# EasyEDA Pro project 单相逆变离并网和整流拓扑.epro, board PCB1
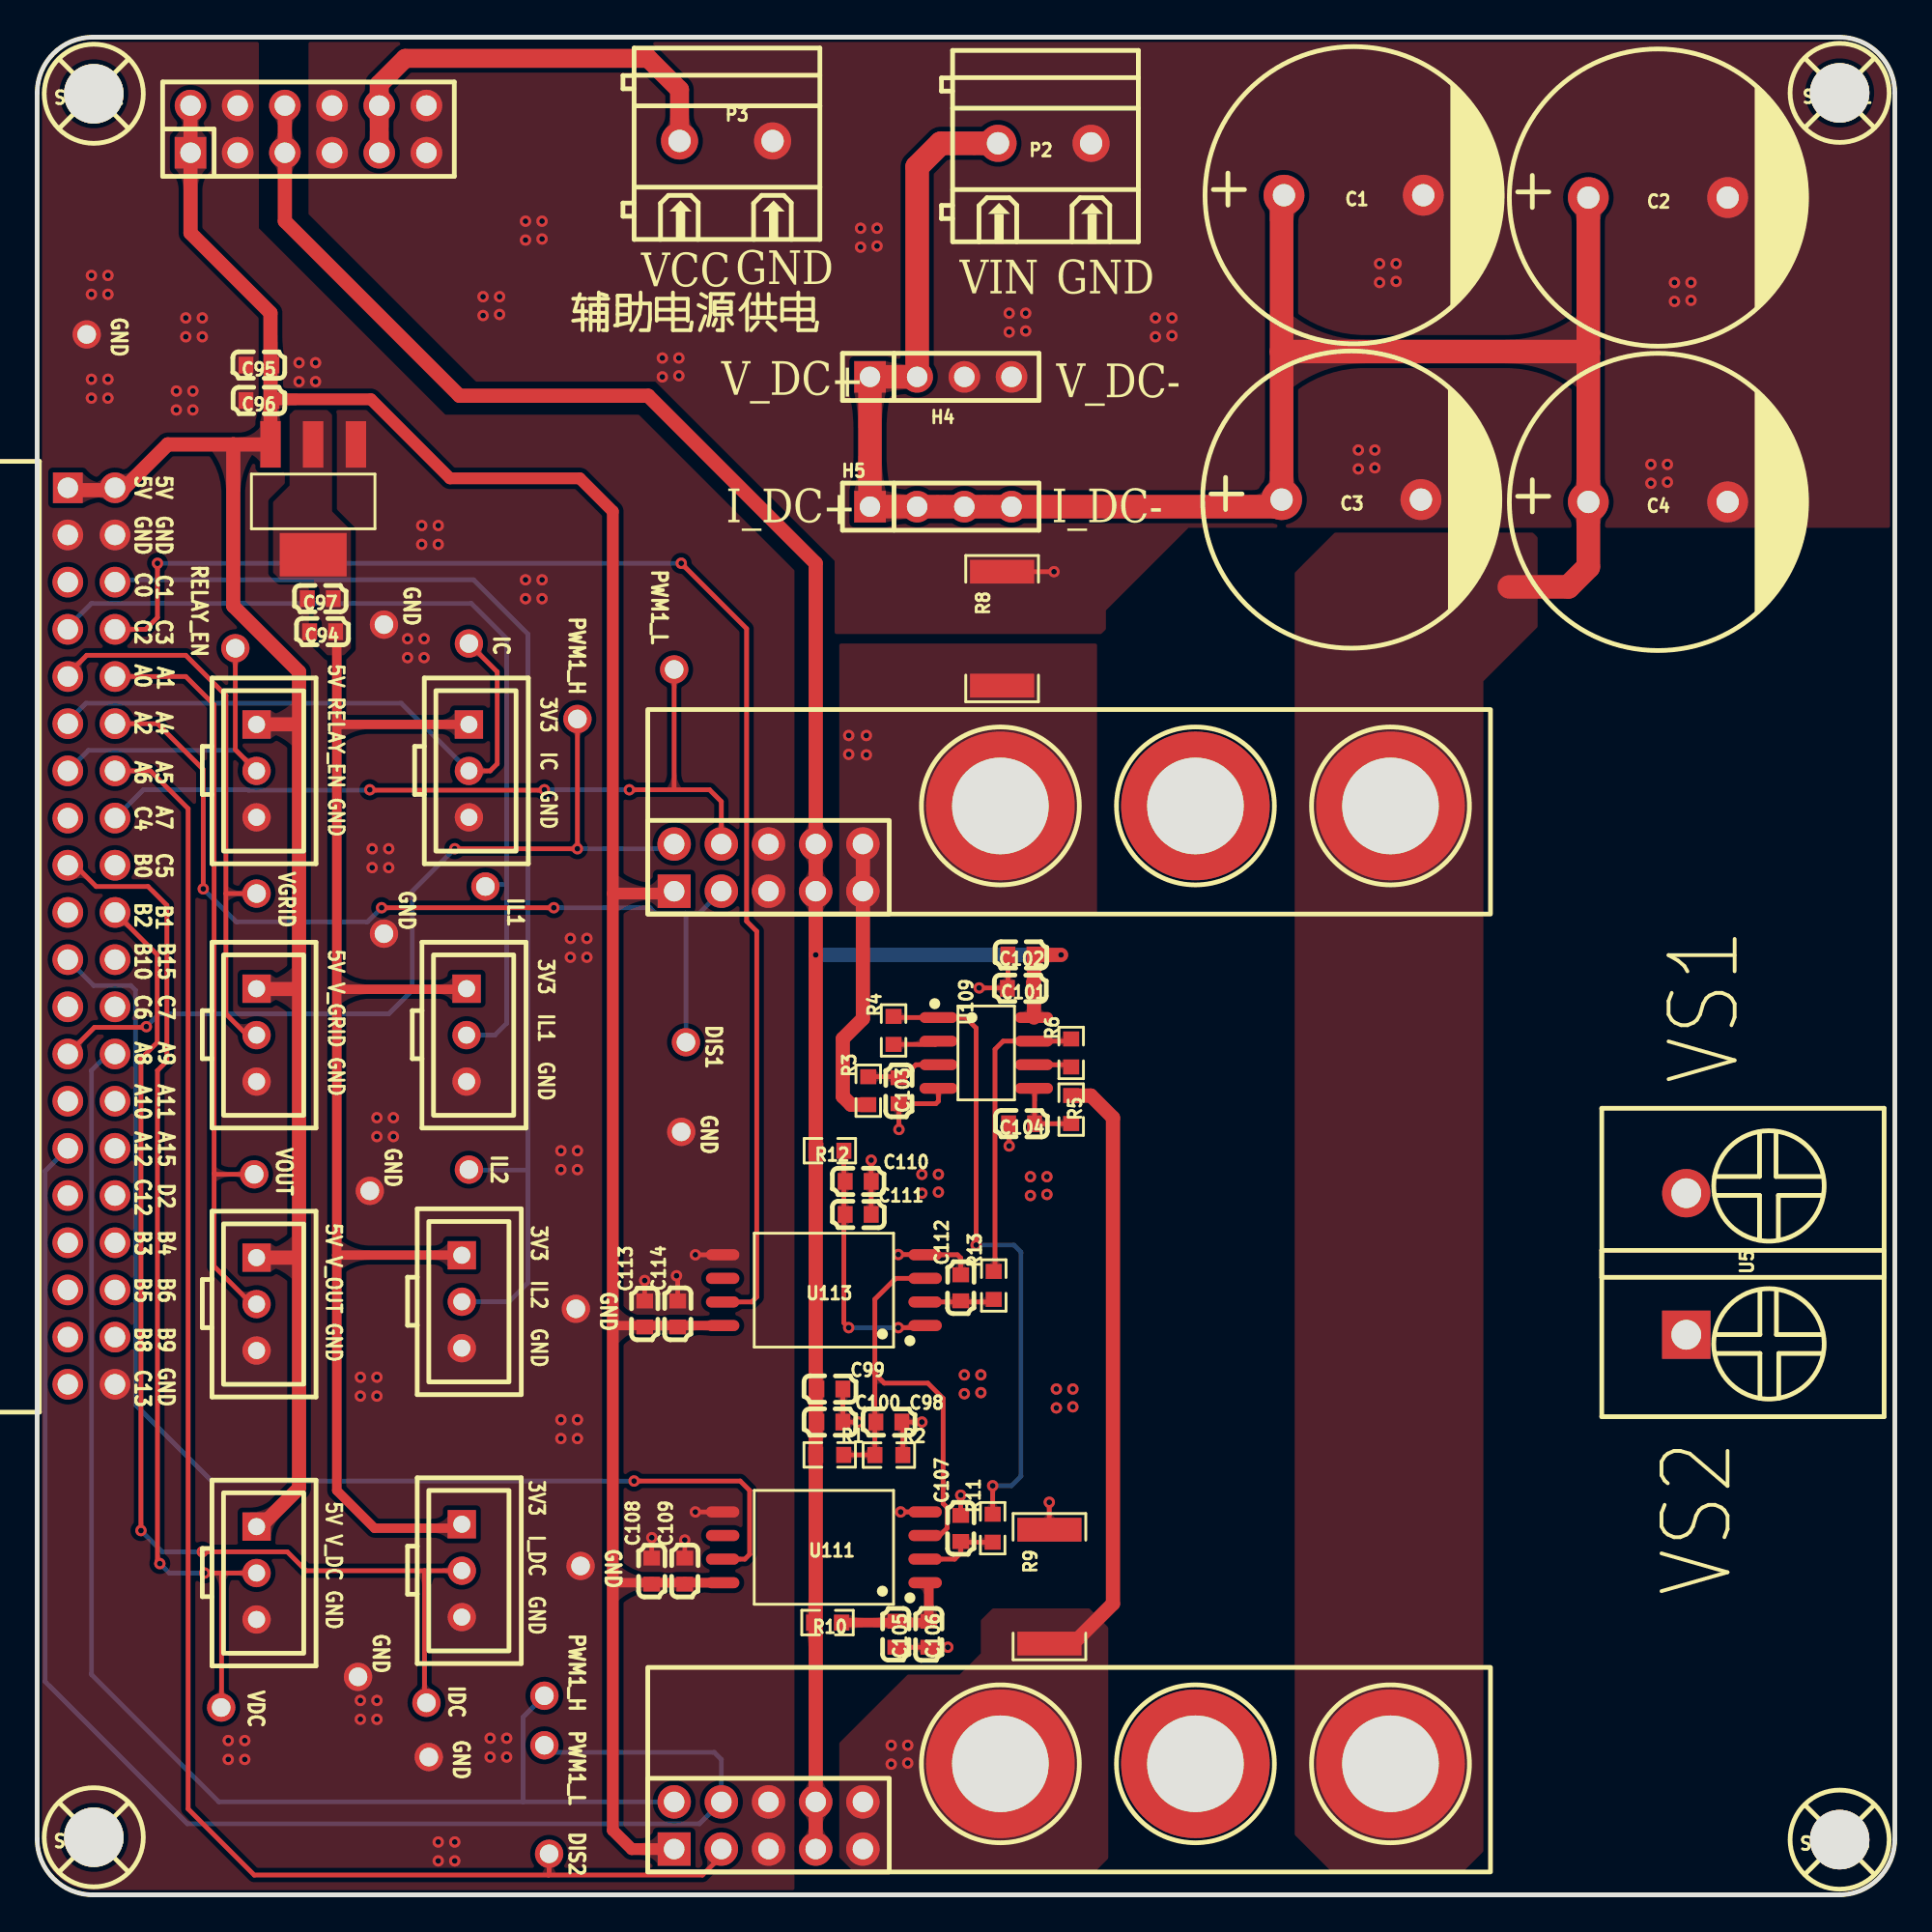
[diagram p4: board, top side]
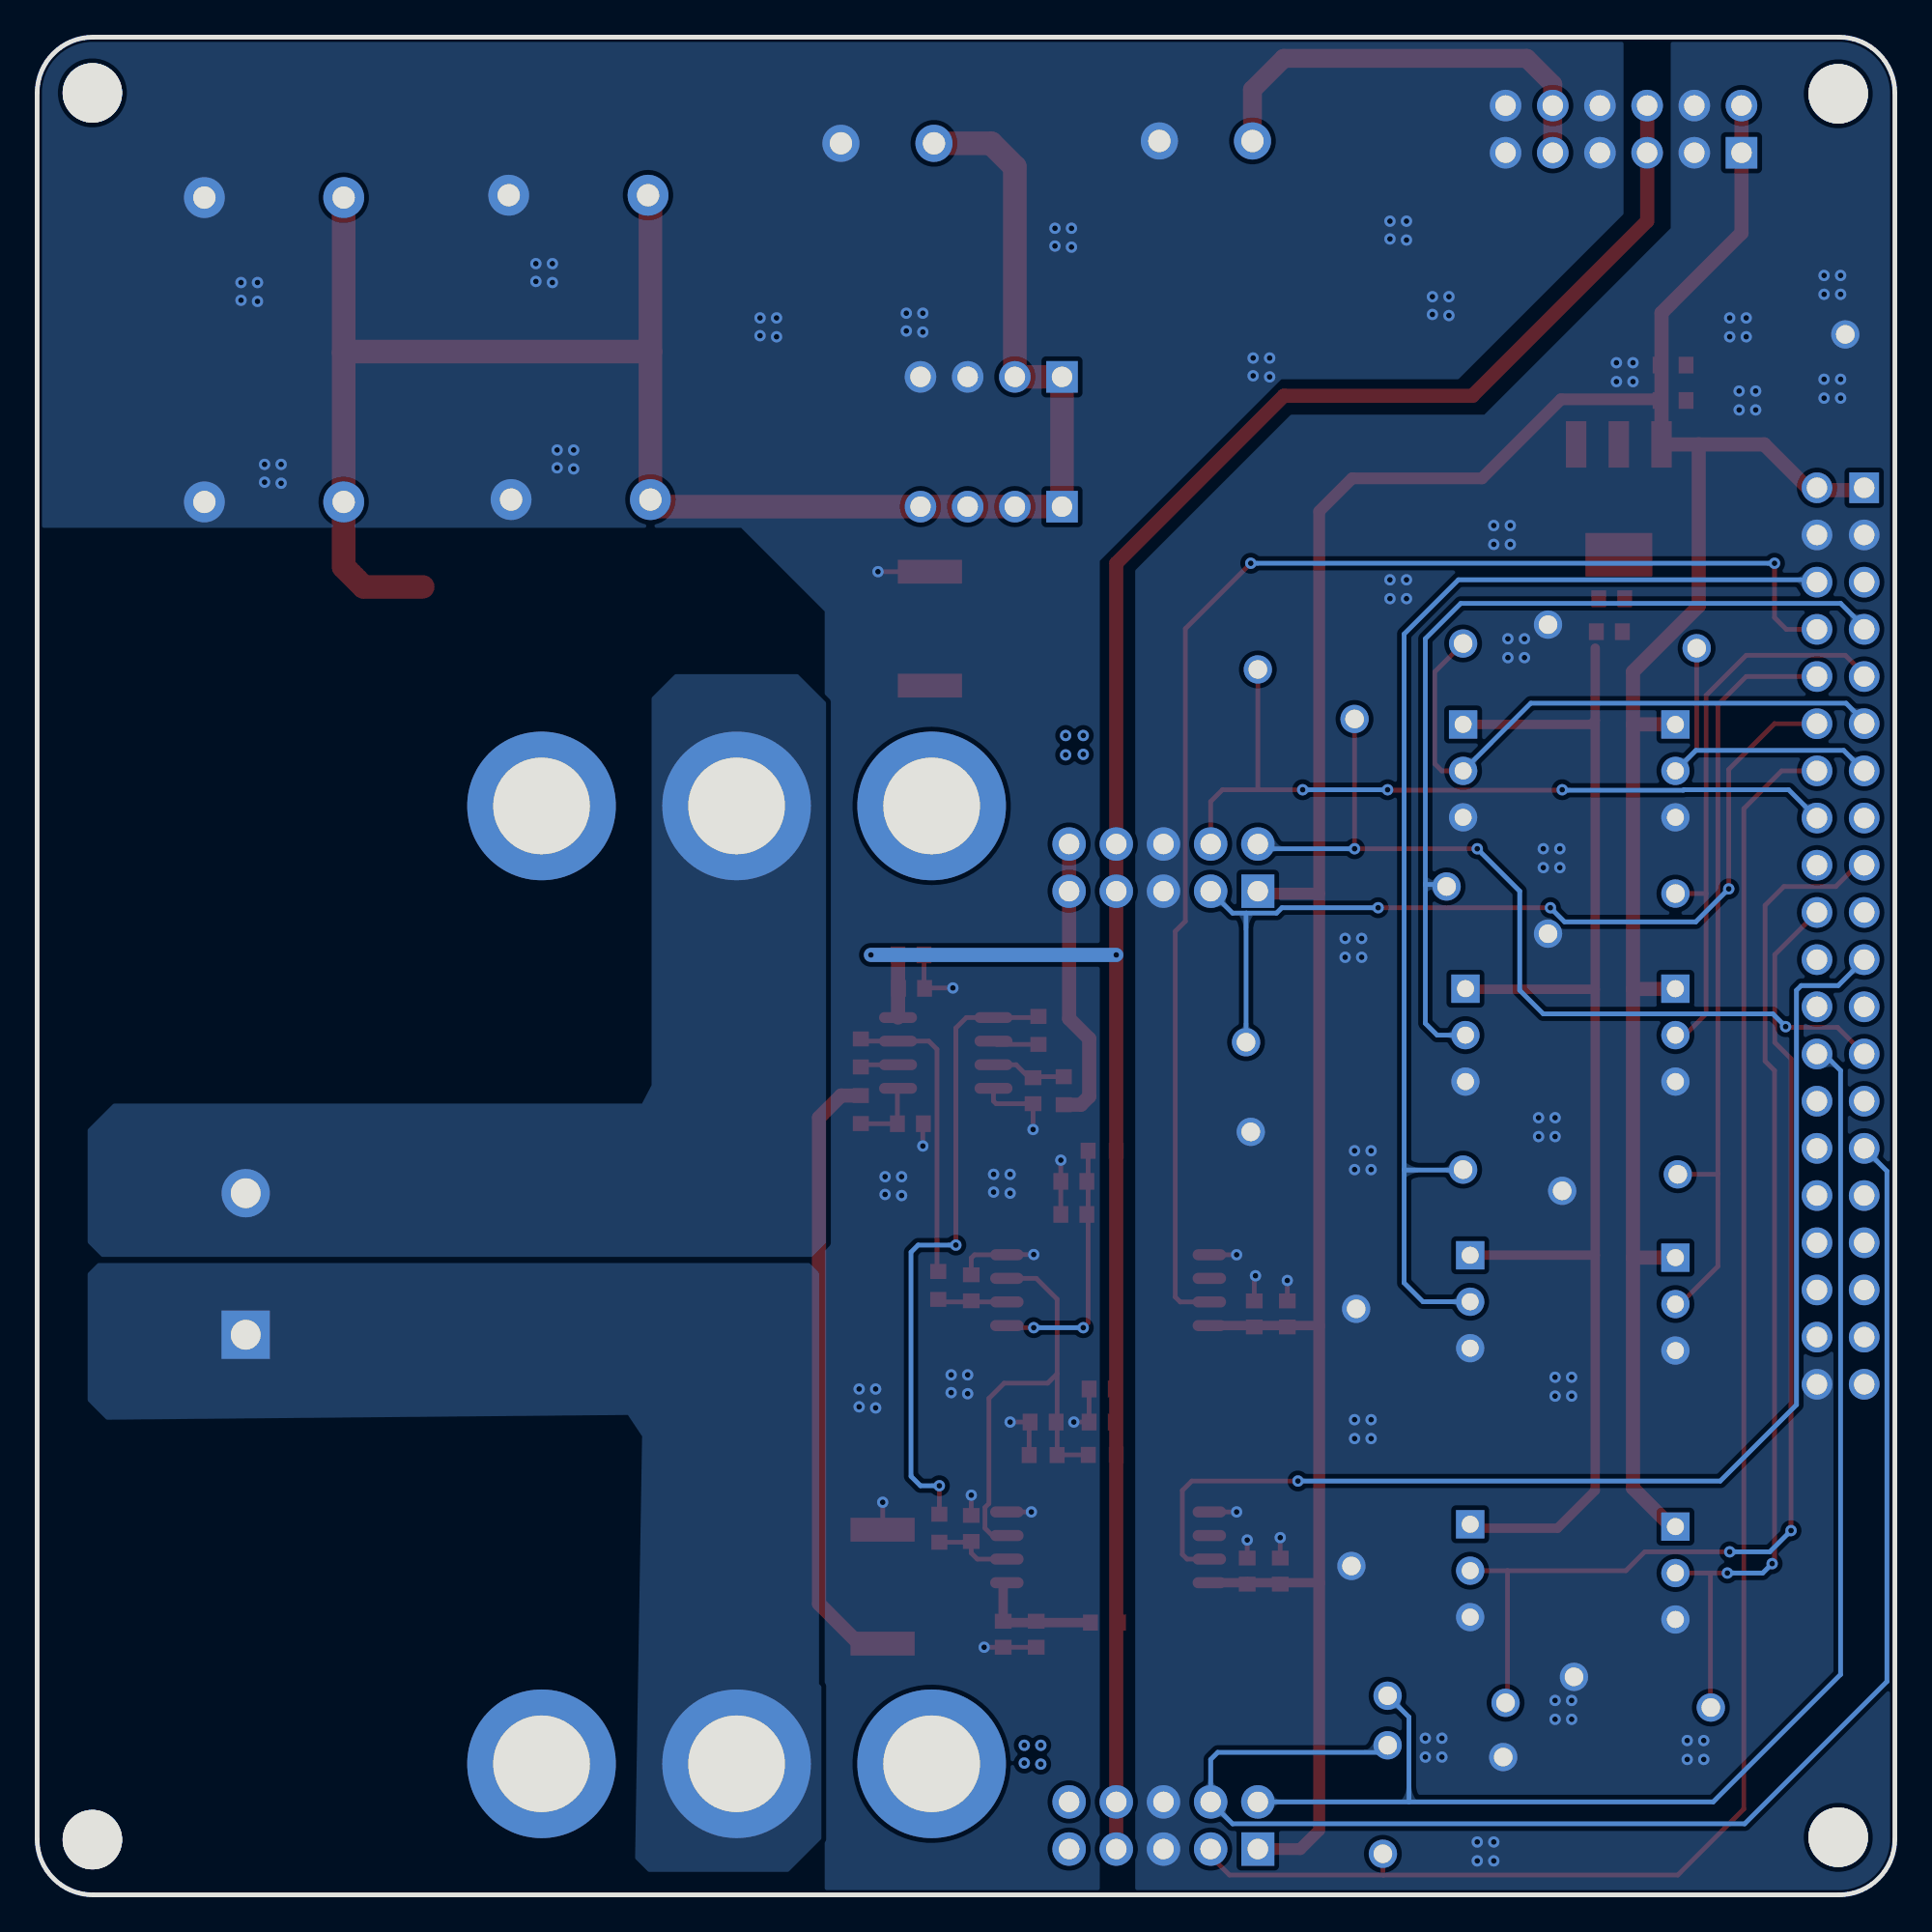
[diagram p5: board, bottom side, seen from below]

Outline 100 x 100 mm; copper layers: Top Layer, Bottom Layer. Coordinates in mm from the lower left corner of the outline.
Outline path: 0,97 0,3 arc(0.88,0.88) 3,0 97,0 arc(99.12,0.88) 100,3 100,97 arc(99.12,99.12) 97,100 3,100 arc(0.88,99.12) 0,97
Stack: Top Layer 0.035mm / Dielectric1 1.51mm FR4 er 4.5 / Bottom Layer 0.035mm

## Design rules (mm)
template: 自定义配置
spacing copperThickness1oz (default): track to track 0.102, other pairs 0.152 to 0.3
spacing copperThickness2oz: track to track 0.203, other pairs 0.152 to 0.3
track width copperThickness1oz (default): min 0.127, default 0.254, max 2.54
track width copperThickness2oz: min 0.203, default 0.254, max 2.54
differential pair differentialPair (default): width min 0.127, default 0.254, max 2.54; gap min 0.152, default 0.152
via viaSize (default): diameter min 0.5, default 0.61, max 10; hole min 0.3, default 0.305, max 6.3

## Placement (name value [footprint] x y rotation side)
5VADC1GND1  WAFER-XH2.54-3PZZ  [CONN-TH_3P-P2.50_WAFER-XH2.54-3PZZ]  11.81 31.8 270 top
5VADC2GND1  WAFER-XH2.54-3PZZ  [CONN-TH_3P-P2.50_WAFER-XH2.54-3PZZ]  11.81 46.28 270 top
5VADC3GND1  WAFER-XH2.54-3PZZ  [CONN-TH_3P-P2.50_WAFER-XH2.54-3PZZ]  11.81 60.5 270 top
5VADC3GND2  WAFER-XH2.54-3PZZ  [CONN-TH_3P-P2.50_WAFER-XH2.54-3PZZ]  11.81 17.32 270 top
5VADC4GND1  WAFER-XH2.54-3PZZ  [CONN-TH_3P-P2.50_WAFER-XH2.54-3PZZ]  22.86 31.93 270 top
5VADC4GND2  WAFER-XH2.54-3PZZ  [CONN-TH_3P-P2.50_WAFER-XH2.54-3PZZ]  22.86 17.45 270 top
5VADC6GND1  WAFER-XH2.54-3PZZ  [CONN-TH_3P-P2.50_WAFER-XH2.54-3PZZ]  23.11 46.28 270 top
5VADC7GND1  WAFER-XH2.54-3PZZ  [CONN-TH_3P-P2.50_WAFER-XH2.54-3PZZ]  23.24 60.5 270 top
AMS1117  A1117-3.3  [SOT-223-3_L6.5-W3.4-P2.30-LS7.0-BR-1]  14.86 75.11 90 top
C1  470uF  [CAP-TH_BD16.0-P7.50-D0.8-FD]  70.87 91.49 0 top
C2  470uF  [CAP-TH_BD16.0-P7.50-D0.8-FD]  87.25 91.36 0 top
C3  470uF  [CAP-TH_BD16.0-P7.50-D0.8-FD]  70.74 75.11 0 top
C4  470uF  [CAP-TH_BD16.0-P7.50-D0.8-FD]  87.25 74.98 0 top
C94  100nF  [电容（0603）]  15.37 68 0 top
C95  100nF  [电容（0603）]  11.94 82.35 0 top
C96  10uF  [C0603]  11.94 80.44 0 top
C97  10uF  [C0603]  15.24 69.77 0 top
C98  10nF  [电容（0603）]  45.85 25.45 180 top
C99  100nF  [电容（0603）]  42.67 27.23 180 top
C100  10uF  [C0603]  42.67 25.45 180 top
C101  100nF  [电容（0603）]  52.93 48.8 0 top
C102  10uF  [C0603]  52.96 50.6 0 top
C103  10nF  [电容（0603）]  46.39 43.29 90 top
C104  10nF  [电容（0603）]  52.99 41.51 0 top
C105  1uF  [C0603]  46.22 14.03 90 top
C106  100nF  [电容（0603）]  48 14.03 90 top
C107  1nF  [电容（0603）]  49.72 19.72 270 top
C108  1uF  [C0603]  33.08 17.43 270 top
C109  100nF  [电容（0603）]  34.86 17.43 270 top
C110  1uF  [C0603]  44.2 38.4 180 top
C111  100nF  [电容（0603）]  44.2 36.63 180 top
C112  1nF  [电容（0603）]  49.72 32.68 270 top
C113  1uF  [C0603]  32.7 31.27 270 top
C114  100nF  [电容（0603）]  34.48 31.27 270 top
H4  直流侧电压检测  [HDR-TH_4P-P2.54-V-F]  48.64 81.71 0 top
H5  直流侧电流检测  [HDR-TH_4P-P2.54-V-F]  48.64 74.73 0 top
NOREF  -  [Pad_e479]  18.67 68.38 0 top
NOREF#2  -  [Pad_e482]  27.56 2.21 0 top
NOREF#3  -  [Pad_e566]  9.91 10.08 0 top
NOREF#4  -  [Pad_e515]  10.67 67.11 0 top
NOREF#5  -  [Pad_e481]  27.31 8.05 0 top
NOREF#6  -  [Pad_e459]  34.93 45.9 0 top
NOREF#7  -  [Pad_e480]  27.31 10.72 0 top
NOREF#8  -  [Pad_e470]  2.67 84 0 top
NOREF#9  -  [Pad_e511]  29 31.55 0 top
NOREF#10  -  [Pad_e509]  18.67 51.74 0 top
NOREF#11  -  [Pad_e476]  34.67 41.07 0 top
NOREF#12  -  [Pad_e553]  11.68 38.79 0 top
NOREF#13  -  [Pad_e533]  11.81 53.9 0 top
NOREF#14  -  [Pad_e551]  17.27 11.73 0 top
NOREF#15  -  [Pad_e554]  23.24 39.04 0 top
NOREF#16  -  [Pad_e549]  17.91 37.9 0 top
NOREF#17  -  [Pad_e540]  24.13 54.28 0 top
NOREF#18  -  [Pad_e513]  29.25 17.7 0 top
NOREF#19  -  [Pad_e485]  21.08 7.42 0 top
NOREF#20  -  [Pad_e567]  20.95 10.34 0 top
NOREF#21  -  [Pad_e426]  34.29 65.96 0 top
NOREF#22  -  [Pad_e516]  23.24 67.36 0 top
NOREF#23  -  [Pad_e405]  29.08 63.3 0 top
P2  WJ128V-5.0-2P  [CONN-TH_2P-P5.00_WJ128V-5.0-2P]  54.23 94.28 0 top
P3  WJ128V-5.0-2P  [CONN-TH_2P-P5.00_WJ128V-5.0-2P]  37.08 94.41 0 top
R1  5.1kΩ  [R0603]  42.66 23.68 180 top
R2  200Ω  [R0603]  45.85 23.67 180 top
R3  10kΩ  [R0603]  44.74 43.29 270 top
R4  10kΩ  [R0603]  46.1 46.53 270 top
R5  10kΩ  [R0603]  55.66 42.27 90 top
R6  10kΩ  [R0603]  55.66 45.32 270 top
R8  0.1Ω  [R2512]  51.94 68.16 270 top
R9  0.1Ω  [R2512]  54.49 16.59 270 top
R10  10Ω  [R0603]  42.54 14.66 0 top
R11  10Ω  [R0603]  51.44 19.74 270 top
R12  10Ω  [R0603]  42.67 40.06 0 top
R13  10Ω  [R0603]  51.49 32.8 270 top
SCREW1  -  [M3螺丝]  97.03 97 0 top
SCREW2  -  [M3螺丝]  3.05 96.95 0 top
SCREW3  -  [M3螺丝]  97.03 2.97 0 top
SCREW4  -  [M3螺丝]  3.05 3.1 0 top
U1  -  [辅助电源板卡-60-12-5]  14.61 95.05 0 top
U3  -  [UCC21520DWR直插封装]  39.37 55.3 0 top
U4  -  [UCC21520DWR直插封装]  39.37 3.73 0 top
U5  桥臂输出  [CONN-TH_2P-P7.62_L15.2-W16.7-EX4.2]  88.77 33.96 90 top
U108  PZ254-2-20-W-8.5  [HDR-TH_40P-P2.54-H-M-R2-C20-S2.54-W12.9-N]  2.92 51.61 270 top
U109  OPA2188AIDR  [SOIC-8_L4.9-W3.9-P1.27-LS6.0-BL]  51.09 45.32 270 top
U111  AMC23C10DWVR  [SOIC-8_L7.5-W5.9-P1.27-LS11.5-BL]  42.35 18.71 90 top
U113  AMC23C10DWVR  [SOIC-8_L7.5-W5.9-P1.27-LS11.5-BL]  42.35 32.55 90 top

## Footprints (pads in the part's own frame, mm; a bottom-side part is the same pattern mirrored in y, then rotated)
C0603
  rect 0.8x0.9 smd: 1(-0.7,0) 2(0.7,0)
CAP-TH_BD16.0-P7.50-D0.8-FD
  round 2.2 hole 1.2: 1(-3.75,0) 2(3.75,0)
CONN-TH_2P-P5.00_WJ128V-5.0-2P
  round 2 hole 1.2: 1(-2.505,0) 2(2.505,0)
CONN-TH_2P-P7.62_L15.2-W16.7-EX4.2
  rect 2.6x2.6 hole 1.6: 1(-3.81,0)
  round 2.6 hole 1.6: 2(3.81,0)
CONN-TH_3P-P2.50_WAFER-XH2.54-3PZZ
  rect 1.524x1.524 hole 0.914: 1(-2.5,0)
  round 1.524 hole 0.914: 2(0,0) 3(2.5,0)
HDR-TH_4P-P2.54-V-F
  rect 1.7x1.7 hole 1.1: 1(-3.81,0)
  round 1.7 hole 1.1: 2(-1.27,0) 3(1.27,0) 4(3.81,0)
HDR-TH_40P-P2.54-H-M-R2-C20-S2.54-W12.9-N
  rect 1.65x1.6 hole 1.1: 1(-24.13,-1.27)
  round 1.65 hole 1.1: 2(-24.13,1.27) 3(-21.59,-1.27) 4(-21.59,1.27) 5(-19.05,-1.27) 6(-19.05,1.27) 7(-16.51,-1.27) 8(-16.51,1.27) 9(-13.97,-1.27) 10(-13.97,1.27) 11(-11.43,-1.27) 12(-11.43,1.27) 13(-8.89,-1.27) 14(-8.89,1.27) 15(-6.35,-1.27) 16(-6.35,1.27) 17(-3.81,-1.27) 18(-3.81,1.27) 19(-1.27,-1.27) 20(-1.27,1.27) 21(1.27,-1.27) 22(1.27,1.27) 23(3.81,-1.27) 24(3.81,1.27) 25(6.35,-1.27) 26(6.35,1.27) 27(8.89,-1.27) 28(8.89,1.27) 29(11.43,-1.27) 30(11.43,1.27) 31(13.97,-1.27) 32(13.97,1.27) 33(16.51,-1.27) 34(16.51,1.27) 35(19.05,-1.27) 36(19.05,1.27) 37(21.59,-1.27) 38(21.59,1.27) 39(24.13,-1.27) 40(24.13,1.27)
M3螺丝
  round 3.2 hole 3.2: 1(0,0)
Pad_e405
  round 1.524 hole 1: 1(0,0)
Pad_e426
  round 1.524 hole 1: 1(0,0)
Pad_e459
  round 1.524 hole 1: 1(0,0)
Pad_e470
  round 1.524 hole 1: 1(0,0)
Pad_e476
  round 1.524 hole 1: 1(0,0)
Pad_e479
  round 1.524 hole 1: 1(0,0)
Pad_e480
  round 1.524 hole 1: 1(0,0)
Pad_e481
  round 1.524 hole 1: 2(0,0)
Pad_e482
  round 1.524 hole 1: 3(0,0)
Pad_e485
  round 1.524 hole 1: 1(0,0)
Pad_e509
  round 1.524 hole 1: 1(0,0)
Pad_e511
  round 1.524 hole 1: 1(0,0)
Pad_e513
  round 1.524 hole 1: 1(0,0)
Pad_e515
  round 1.524 hole 1: 1(0,0)
Pad_e516
  round 1.524 hole 1: 2(0,0)
Pad_e533
  round 1.524 hole 1: 1(0,0)
Pad_e540
  round 1.524 hole 1: 1(0,0)
Pad_e549
  round 1.524 hole 1: 1(0,0)
Pad_e551
  round 1.524 hole 1: 1(0,0)
Pad_e553
  round 1.524 hole 1: 1(0,0)
Pad_e554
  round 1.524 hole 1: 2(0,0)
Pad_e566
  round 1.524 hole 1: 1(0,0)
Pad_e567
  round 1.524 hole 1: 2(0,0)
R0603
  rect 0.806x0.864 smd: 1(-0.753,0) 2(0.753,0)
R2512
  rect 1.282x3.456 smd: 1(-3.067,0) 2(3.067,0)
SOIC-8_L4.9-W3.9-P1.27-LS6.0-BL
  oval 0.588x2.045 smd: 1(-1.905,-2.57) 2(-0.635,-2.57) 3(0.635,-2.57) 4(1.905,-2.57) 5(1.905,2.57) 6(0.635,2.57) 7(-0.635,2.57) 8(-1.905,2.57)
SOIC-8_L7.5-W5.9-P1.27-LS11.5-BL
  oval 0.6x1.8 smd: 1(-1.905,-5.45) 2(-0.635,-5.45) 3(0.635,-5.45) 4(1.905,-5.45) 5(1.905,5.45) 6(0.635,5.45) 7(-0.635,5.45) 8(-1.905,5.45)
SOT-223-3_L6.5-W3.4-P2.30-LS7.0-BR-1
  rect 2.5x1.1 smd: 1(2.97,-2.3) 2(2.97,0) 3(2.97,2.3)
  rect 2.34x3.6 smd: 2(-2.97,0)
UCC21520DWR直插封装
  rect 1.778x1.8 hole 1.1: 1(-5.08,-1.27)
  round 1.8 hole 1.1: 2(-5.08,1.27) 3(-2.54,-1.27) 4(-2.54,1.27) 5(0,-1.27) 6(0,1.27) 7(2.54,-1.27) 8(2.54,1.27) 9(5.08,-1.27) 10(5.08,1.27)
  round 8 hole 5.2: 11(12.48,3.32) 12(22.98,3.32) 13(33.48,3.32)
电容（0603）
  rect 0.8x0.9 smd: 1(-0.7,0) 2(0.7,0)
辅助电源板卡-60-12-5
  rect 1.7x1.7 hole 1.1: 1(-6.35,-1.27)
  round 1.7 hole 1.1: 2(-6.35,1.27) 3(-3.81,-1.27) 4(-3.81,1.27) 5(-1.27,-1.27) 6(-1.27,1.27) 7(1.27,-1.27) 8(1.27,1.27) 9(3.81,-1.27) 10(3.81,1.27) 11(6.35,-1.27) 12(6.35,1.27)

## Nets
3V3: 5VADC4GND1.1 5VADC4GND2.1 5VADC6GND1.1 5VADC7GND1.1 AMS1117.2 C94.2 C97.2
5V: 5VADC1GND1.1 5VADC2GND1.1 5VADC3GND1.1 5VADC3GND2.1 AMS1117.3 C95.2 C96.2 C108.2 C109.2 C113.2 C114.2 U1.1 U1.2 U3.1 U4.1 U108.1 U108.2 U111.8 U113.8
12V: C99.2 C100.2 C101.2 C102.2 R1.2 R10.1 R12.1 U1.5 U1.6 U3.7 U3.8 U4.7 U4.8 U109.8
AGND: 5VADC1GND1.3 5VADC2GND1.3 5VADC3GND1.3 5VADC3GND2.3 5VADC4GND1.3 5VADC4GND2.3 5VADC6GND1.3 5VADC7GND1.3 AMS1117.1 C94.1 C95.1 C96.1 C97.1 C108.1 C109.1 C113.1 C114.1 NOREF.1 NOREF#8.1 NOREF#9.1 NOREF#10.1 NOREF#11.1 NOREF#14.1 NOREF#16.1 NOREF#18.1 NOREF#19.1 U1.3 U1.4 U3.5 U3.6 U4.5 U4.6 U108.3 U108.4 U108.40 U111.5 U113.5
PGND: C1.2 C2.2 C3.2 C4.2 C98.1 C99.1 C100.1 C101.1 C102.1 C103.1 C104.1 C105.1 C106.1 C107.1 C110.1 C111.1 C112.1 H4.3 H4.4 P2.2 P3.2 R2.1 R8.1 R9.1 U1.7 U1.8 U1.11 U1.12 U109.4 U111.4 U113.4
PGND1: R3.2 R8.2 U3.9 U3.10 U3.11
PGND2: R5.2 R9.2 U4.9 U4.10 U4.11
VCC: P3.1 U1.9 U1.10
DIS1: NOREF#6.1 U3.3 U108.12
DIS2: NOREF#2.3 U4.3 U108.14
I_DC: 5VADC4GND2.2 NOREF#20.2 U108.20
I_DC+: C1.1 C2.1 C3.1 C4.1 H4.1 H4.2 H5.1 H5.2 H5.3 H5.4 P2.1 U3.13 U4.13
IC: 5VADC7GND1.2 NOREF#22.2 U108.11
IL1: 5VADC6GND1.2 NOREF#17.1 U108.7
IL2: 5VADC4GND1.2 NOREF#15.2 U108.6
PA0: 5VADC2GND1.2 NOREF#13.1 U108.9
PA1: 5VADC1GND1.2 NOREF#12.1 U108.10
PA6: 5VADC3GND1.2 NOREF#4.1 U108.13
PA7: NOREF#21.1 U3.4 U108.16
PA8: NOREF#23.1 U3.2 U108.25
PA9: NOREF#7.1 U4.2 U108.26
PA10: U108.27
PA11: U108.28
PA12: NOREF#5.2 U4.4 U108.29
PA15: U108.30
PB0: 5VADC3GND2.2 NOREF#3.1 U108.17
PB2: U108.19
PB3: U108.33
PB4: U108.34
PB5: U108.35
PB6: U108.36
PB7: U108.37
PB9: U108.38
PB10: U108.21 U111.7
PB15: U108.22
PC0: U108.5
PC3: U108.8 U113.7
PC4: U108.15
PC5: U108.18
PC6: U108.23
PC7: U108.24
PC12: U108.31
PC13: U108.39
PD2: U108.32
VH_1: R4.1 R11.1 U109.1
VH_2: R6.1 R13.1 U109.7
VREF: C98.2 R1.1 R2.2 U111.3 U113.3
VS1: U3.12 U5.2
VS2: U4.12 U5.1
$1N3465: C103.2 R3.1 U109.3
$1N3512: R4.2 U109.2
$1N3800: C104.2 R5.1 U109.5
$1N3825: R6.2 U109.6
$1N4645: C105.2 C106.2 R10.2 U111.1
$1N4750: C107.2 R11.2 U111.2
$1N5405: C112.2 R13.2 U113.2
$1N5409: C110.2 C111.2 R12.2 U113.1

Pads without a net: SCREW1 1; SCREW2 1; SCREW3 1; SCREW4 1; U111 6; U113 6

## Via types
v1: diameter 0.61, hole 0.305, Top Layer to Bottom Layer, 176 vias

## Routing (per net, layer and track width the routed paths; a pad name or vN(x,y) marks a point on that pad's centre or on a via; arc(x,y) is an arc through that point)
3V3: length 73.9
  Top Layer w0.508: 16.13,34.44 16.13,21.77 18.16,19.74 22.65,19.74 5VADC4GND2.1 ; 16.13,34.44 22.85,34.44 5VADC4GND1.1 ; 16.13,34.44 16.13,48.75 ; 16.13,63.22 16.35,63 5VADC7GND1.1 ; 16.13,63.22 16.13,67.11 ; 16.13,63.22 16.13,48.75 ; 5VADC6GND1.1 23.08,48.75 16.13,48.75
5V: length 210.3
  Top Layer w0.508: 30.99,30.62 31.01,30.65 32.78,30.65 ; U111.8 34.91,16.8 ; 34.91,16.8 34.81,16.8 ; 34.91,16.8 34.86,16.85 34.81,16.8 ; 34.81,16.8 33.14,16.8 ; 32.78,30.65 C113.2 ; 32.78,30.65 U113.8 ; 33.14,16.8 33.08,16.85 ; 33.14,16.8 31,16.8 30.99,16.79
  Top Layer w0.635: C96.2 12.7,80.51 17.97,80.51 22.22,76.25 29.21,76.25 30.99,74.47 30.99,53.9 ; U3.1 34.16,53.9 30.99,53.9 ; 30.99,53.9 30.99,3.48 32,2.46 34.29,2.46
  Top Layer w0.762: 14.1,34.3 14.1,21.89 12.24,20.03 ; 14.1,34.3 14.1,48.76 ; 14.1,34.3 5VADC1GND1.1 ; 10.56,78.08 AMS1117.3 12.56,85.15 8.25,89.46 U1.1 U1.2 ; 10.56,78.08 7.03,78.08 4.57,75.62 1.78,75.62 U108.1 ; 10.56,78.08 10.56,69.38 14.1,65.84 14.1,63.01 ; 14.1,63.01 14.1,48.76 ; 14.1,63.01 11.82,63.01 5VADC3GND1.1 ; 14.1,48.76 11.83,48.76 5VADC2GND1.1
12V: length 129.7
  Top Layer w0.762: 41.91,2.46 U4.8 R1.2 v1(41.91,50.6) U3.7 U3.8 41.91,71.68 32.89,80.7 22.73,80.7 13.33,90.09 U1.5 U1.6 ; v1(55.12,50.6) C102.2 U109.8
  Bottom Layer w0.762: v1(55.12,50.6) v1(41.91,50.6)
AGND: length 7.5
  Top Layer w0.254: C109.1 v1(34.86,19.1) ; v1(34.42,33.32) 34.48,33.26 C114.1 ; U113.5 v1(35.43,34.46) ; U111.5 v1(35.43,20.61) ; C108.1 v1(33.08,19.23) ; C113.1 v1(32.7,33.07)
  vias: v1(2.92,87.17) v1(2.92,86.16) v1(2.92,81.58) v1(2.92,80.57) v1(3.81,87.17) v1(3.81,86.16) v1(3.81,81.58) v1(3.81,80.57) v1(7.49,80.95) v1(7.49,79.93) v1(8,84.89) v1(8,83.87) v1(8.38,80.95) v1(8.38,79.93) v1(8.89,84.89) v1(8.89,83.87) v1(10.29,8.31) v1(10.29,7.29) v1(11.18,8.31) v1(11.18,7.29) v1(14.1,82.47) v1(14.1,81.46) v1(14.99,82.47) v1(14.99,81.46) v1(17.4,27.86) v1(17.4,26.85) v1(17.4,10.47) v1(17.4,9.45) v1(18.03,56.31) v1(18.03,55.3) v1(18.29,41.83) v1(18.29,40.82) v1(18.29,27.86) v1(18.29,26.85) v1(18.29,10.47) v1(18.29,9.45) v1(18.92,56.31) v1(18.92,55.3) v1(19.18,41.83) v1(19.18,40.82) v1(19.94,67.61) v1(19.94,66.6) v1(20.7,73.71) v1(20.7,72.69) v1(20.83,67.61) v1(20.83,66.6) v1(21.59,73.71) v1(21.59,72.69) v1(21.59,2.84) v1(21.59,1.83) v1(22.48,2.84) v1(22.48,1.83) v1(24.38,8.43) v1(24.38,7.42) v1(25.27,8.43) v1(25.27,7.42) v1(26.29,70.79) v1(26.29,69.77) v1(27.18,70.79) v1(27.18,69.77) v1(28.19,40.06) v1(28.19,39.04) v1(28.19,25.58) v1(28.19,24.56) v1(28.7,51.49) v1(28.7,50.47) v1(29.08,40.06) v1(29.08,39.04) v1(29.08,25.58) v1(29.08,24.56) v1(29.59,51.49) v1(29.59,50.47)
PGND: length 31
  Top Layer w0.254: C105.1 C106.1 v1(49.02,13.33) ; v1(50.71,48.82) 52.21,48.82 C101.1 52.26,48.82 C102.1 ; v1(44.2,25.45) C100.1 C99.1 ; 51.94,71.23 v1(54.74,71.23) ; U111.4 v1(46.48,20.61) ; C107.1 v1(49.72,21.51) ; R2.1 46.6,25.4 C98.1 v1(47.62,25.45) ; v1(46.39,41.2) C103.1 48.38,42.59 48.52,42.73 U109.4 ; C111.1 C110.1 v1(44.9,39.55) ; R9.1 54.48,19.66 v1(54.48,21.13) ; C104.1 52.32,41.48 v1(52.32,40.31) ; v1(46.35,34.47) 47.79,34.47 U113.4 49.54,34.46 49.72,34.28 C112.1
  vias: v1(24,86.03) v1(24,85.01) v1(24.89,86.03) v1(24.89,85.07) v1(26.29,90.09) v1(26.29,89.08) v1(27.18,90.09) v1(27.18,89.14) v1(33.66,82.73) v1(33.66,81.71) v1(34.54,82.73) v1(34.54,81.77) v1(44.32,89.71) v1(44.32,88.7) v1(45.21,89.71) v1(45.21,88.76) v1(47.62,38.79) v1(47.62,37.77) v1(48.51,38.79) v1(48.51,37.83) v1(49.91,27.99) v1(49.91,26.97) v1(50.8,27.99) v1(50.8,27.03) v1(52.32,85.14) v1(52.32,84.12) v1(53.21,85.14) v1(53.21,84.18) v1(53.47,38.66) v1(53.47,37.64) v1(54.36,38.66) v1(54.36,37.7) v1(54.86,27.23) v1(54.86,26.21) v1(55.75,27.23) v1(55.75,26.27) v1(60.2,84.89) v1(60.2,83.87) v1(61.09,84.89) v1(61.09,83.93) v1(71.12,77.77) v1(71.12,76.76) v1(72.01,77.77) v1(72.01,76.82) v1(72.26,87.81) v1(72.26,86.79) v1(73.15,87.81) v1(73.15,86.85) v1(86.87,77) v1(86.87,75.99) v1(87.76,77) v1(87.76,76.05) v1(88.14,86.79) v1(88.14,85.78) v1(89.03,86.79) v1(89.03,85.83)
PGND1: length 15.6
  Top Layer w0.762: R3.2 43.81,42.53 43.37,42.98 43.37,46.09 44.45,47.17 U3.9 U3.10
  vias: v1(43.69,62.41) v1(43.69,61.39) v1(44.64,62.41) v1(44.64,61.36)
PGND2: length 33.4
  Top Layer w0.762: R9.2 54.49,13.39 55.63,13.39 57.91,15.67 57.91,41.83 56.72,43.03 R5.2
  vias: v1(45.97,8.05) v1(45.97,7.04) v1(46.86,8.05) v1(46.86,7.09)
VCC: length 23.9
  Top Layer w1.016: P3.1 34.58,97.17 32.89,98.86 19.81,98.86 18.42,97.46 U1.10 U1.9
DIS1: length 48.7
  Top Layer w0.254: U108.12 6.48,63.04 8.94,60.58 v1(8.94,54.15) ; v1(27.81,53.14) v1(18.54,53.14)
  Bottom Layer w0.254: 34.91,52.85 34.93,52.83 NOREF#6.1 ; 34.91,52.85 33.29,52.85 33,53.14 v1(27.81,53.14) ; 34.91,52.85 35.65,52.85 U3.3 ; v1(18.54,53.14) 17.78,52.37 10.72,52.37 v1(8.94,54.15)
DIS2: length 90.8
  Top Layer w0.254: U108.14 6.1,60.5 8.13,58.47 8.13,4.62 11.68,1.07 27.53,1.07 ; 27.53,1.07 27.56,1.1 NOREF#2.3 ; 27.53,1.07 35.81,1.07 36.83,2.08 36.83,2.46
I_DC: length 59.9
  Top Layer w0.254: 5VADC4GND2.2 20.85,17.45 ; 20.85,17.45 20.85,10.44 NOREF#20.2 ; 20.85,17.45 14.48,17.45 13.46,18.47 v1(8.89,18.47) ; U108.20 6.46,50.61 6.46,45.88 5.59,45.01 v1(5.59,19.61)
  Bottom Layer w0.254: v1(5.59,19.61) 6.73,18.47 v1(8.89,18.47)
I_DC+: length 105.2
  Top Layer w1.27: 66.99,83.08 C3.1 66.61,74.73 H5.4 H5.3 H5.1 H4.1 47.37,81.71 ; 66.99,83.08 66.99,91.36 C1.1 ; 66.99,83.08 83.44,83.08 83.5,83.02 ; 47.37,82.09 47.37,93.01 48.64,94.28 P2.1 ; 83.5,83.02 C4.1 83.5,71.48 82.42,70.41 79.25,70.41 ; 83.5,83.02 C2.1
IC: length 32.5
  Top Layer w0.254: 5VADC7GND1.2 24.38,60.5 24.77,60.88 24.77,65.84 NOREF#22.2
  Bottom Layer w0.254: 1.52,63.04 2.63,64.15 19.6,64.15 5VADC7GND1.2
IL1: length 49.4
  Bottom Layer w0.254: NOREF#17.1 24.24,54.39 25.27,54.39 ; 25.27,54.39 25.27,67.61 23.37,69.52 2.92,69.52 1.52,68.12 ; 25.27,54.39 25.27,46.91 24.64,46.28 5VADC6GND1.2
IL2: length 65.7
  Bottom Layer w0.254: 5VADC4GND1.2 25.4,31.93 26.42,32.94 26.42,39.02 ; 4.06,70.66 4.19,70.79 23.5,70.79 26.42,67.87 26.42,39.02 ; 26.42,39.02 23.27,39.02 NOREF#15.2
PA0: length 31.1
  Top Layer w0.254: 10.16,53.9 10.16,64.57 8,66.73 2.67,66.73 1.52,65.58 ; 10.16,53.9 10.16,47.42 11.38,46.2 11.74,46.2 5VADC2GND1.2 ; 10.16,53.9 11.56,53.9 11.81,54.15
PA1: length 41.6
  Top Layer w0.254: 5VADC1GND1.2 11.56,31.8 9.53,33.83 9.53,38.83 ; 9.53,38.83 9.53,64.06 8,65.58 4.06,65.58 ; 9.53,38.83 9.57,38.79 NOREF#12.1
PA6: length 18.3
  Top Layer w0.254: 5VADC3GND1.2 10.67,61.65 NOREF#4.1
  Bottom Layer w0.254: 5VADC3GND1.2 10.71,61.61 2.75,61.61 U108.13 1.52,60.5
PA7: length 42.3
  Top Layer w0.254: v1(17.91,59.49) 17.93,59.46 27.28,59.46 v1(27.31,59.49) ; 34.3,59.49 36.19,59.49 36.83,58.85 U3.4 ; 34.3,59.49 34.29,59.49 NOREF#21.1 ; 34.3,59.49 v1(31.88,59.49)
  Bottom Layer w0.254: U108.16 5.72,59.49 11.35,59.49 11.38,59.46 17.88,59.46 v1(17.91,59.49) ; v1(31.88,59.49) v1(27.31,59.49)
PA8: length 47.7
  Top Layer w0.254: v1(22.48,56.31) v1(29.08,56.31) 29.08,63.17 29.34,63.42 ; U108.25 3.09,46.7 5.84,46.7 v1(5.88,46.73)
  Bottom Layer w0.254: v1(5.88,46.73) 6.57,47.42 18.92,47.42 20.19,48.69 20.19,54.03 v1(22.48,56.31) ; v1(29.08,56.31) 34.04,56.31 U3.2
PA9: length 74.6
  Bottom Layer w0.254: 26.16,5 9.78,5 2.92,11.86 2.92,44.37 3.81,45.26 U108.26 ; 26.16,5 U4.2 ; 26.16,5 26.16,9.57 NOREF#7.1
PA12: length 81.4
  Bottom Layer w0.254: NOREF#5.2 27.69,7.67 36.45,7.67 36.83,7.29 U4.4 35.65,3.82 8.08,3.82 0.43,11.48 0.43,38.96 U108.29
PB0: length 54.6
  Top Layer w0.254: NOREF#3.1 9.93,10.11 9.93,17.32 ; 9.93,17.32 v1(9.02,17.32) ; 9.93,17.32 5VADC3GND2.2 ; U108.17 2.03,55.42 3.17,54.28 5.97,54.28 6.98,53.26 6.98,44.88 6.48,44.37 6.48,17.96 v1(6.6,17.83)
  Bottom Layer w0.254: v1(9.02,17.32) 7.11,17.32 v1(6.6,17.83)
PB10: length 66.6
  Top Layer w0.254: v1(32.13,22.28) 37.85,22.28 38.35,21.77 38.35,18.33 38.1,18.07 U111.7
  Bottom Layer w0.254: U108.21 3.05,48.95 5.04,48.95 5.3,48.69 5.3,26.38 9.4,22.28 v1(32.13,22.28)
PC3: length 76.8
  Top Layer w0.254: U113.7 38.47,31.92 38.74,32.18 38.74,51.87 38.19,52.41 38.19,68.16 v1(34.67,71.68) ; v1(6.48,71.68) 6.48,68.76 5.84,68.12 U108.8
  Bottom Layer w0.254: v1(34.67,71.68) v1(6.48,71.68)
VH_1: length 34.3
  Top Layer w0.254: v1(50.55,34.98) 50.55,46.66 49.98,47.22 U109.1 46.16,47.22 R4.1 ; v1(51.44,22.02) R11.1
  Bottom Layer w0.254: v1(50.55,34.98) 52.58,34.98 52.96,34.59 52.96,22.53 52.45,22.02 v1(51.44,22.02)
VH_2: length 16.2
  Top Layer w0.254: R6.1 55.54,45.95 U109.7 52,45.95 51.56,45.52 51.56,33.75 51.49,33.68
VREF: length 25.9
  Top Layer w0.254: R1.1 45.09,23.68 R2.2 45.09,28.05 ; U111.3 48.58,19.34 48.98,19.74 48.98,20.85 48.77,21.06 48.77,26.72 47.94,27.54 45.6,27.54 45.09,28.05 ; 45.09,28.05 45.09,32.06 46.22,33.19 U113.3
$1N3465: length 4
  Top Layer w0.254: R3.1 46.66,44.04 47.3,44.68 U109.3
$1N3512: length 2.5
  Top Layer w0.254: U109.2 48.34,45.78 R4.2
$1N3800: length 3.9
  Top Layer w0.254: U109.5 53.69,43.38 C104.2 55.65,41.51 R5.1
$1N3825: length 2.1
  Top Layer w0.254: U109.6 55.54,44.68 R6.2
$1N4645: length 6.9
  Top Layer w0.508: U111.1 48,16.6 C106.2 47.93,14.66 R10.2
$1N4750: length 4.4
  Top Layer w0.254: U111.2 49.39,18.07 49.72,18.4 C107.2 49.76,18.98 R11.2
$1N5405: length 3.8
  Top Layer w0.254: U113.2 51.23,31.92 51.49,32.18
$1N5409: length 13.8
  Top Layer w0.254: v1(46.35,30.53) 47.69,30.53 U113.1 ; v1(43.69,30.53) 43.43,30.79 R12.2
  Bottom Layer w0.254: v1(43.69,30.53) v1(46.35,30.53)

## Copper pours and planes (outline as drawn; the poured copper is in the pictures)
3V3 on Top Layer: 15.62,79.93 15.88,79.68 15.88,74.47 16.89,73.46 16.89,67.11 16.51,66.73 15.62,66.73 14.88,67.46 14.88,70.79 13.08,70.79 12.7,71.17 12.7,74.98 13.59,75.87 13.59,79.68 13.84,79.93
AGND on Top Layer: 11.94,101.4 11.94,89.71 21.97,79.68 32.38,79.68 40.77,71.3 40.77,-1.22 39.62,-2.36 -1.27,-2.36 -5.08,1.45 -5.08,101.52 -4.95,101.65 8.51,101.65 9.14,101.02 11.56,101.02
AGND on Bottom Layer: 12.06,101.4 12.06,89.71 22.1,79.68 32.51,79.68 40.89,71.3 40.89,-1.22 39.75,-2.36 -1.14,-2.36 -4.95,1.45 -4.95,101.52 -4.83,101.65 8.64,101.65 9.27,101.02 11.68,101.02
PGND on Top Layer: 103.25,102.29 14.61,102.29 14.61,90.47 23.62,81.46 33.27,81.46 42.93,71.81 42.93,67.87 57.28,67.87 57.53,68.12 57.53,69.14 61.98,73.58 102.24,73.58 103.25,74.6
PGND on Bottom Layer: 14.61,103.08 14.61,90.47 23.5,81.58 33.02,81.58 42.8,71.81 42.8,-0.58 43.56,-1.35 56.26,-1.35 57.6,0 57.6,69.09 62.1,73.58 100.97,73.58 101.85,74.47 101.85,100.89 100.58,102.16 15.53,102.16
PGND1 on Top Layer: 43.18,67.36 57.06,67.36 57.06,52.8 43.18,52.8
PGND2 on Top Layer: 43.96,1.23 56.94,1.23 57.66,1.96 57.66,14.4 56.64,15.42 51.44,15.42 50.8,14.78 50.8,13 49.66,11.86 46.86,11.86 43.18,8.18 43.18,2.02
I_DC+ on Top Layer: 80.77,68.25 77.85,65.33 77.85,2.34 76.84,1.32 69.6,1.32 67.69,3.23 67.69,71.17 69.85,73.33 80.52,73.33 80.77,73.08
VS1 on Bottom Layer: 59.05,65.71 65.66,65.71 66.93,64.44 66.93,43.57 67.44,42.6 95.88,42.6 97.28,41.2 97.28,35.1 96.52,34.34 58.29,34.34 57.53,35.1 57.53,64.19
VS2 on Bottom Layer: 57.78,11.23 57.78,3.01 59.56,1.23 67.1,1.23 67.81,1.95 67.44,24.69 68.2,25.83 96.27,25.58 97.28,26.59 97.28,33.45 96.73,34.01 58.43,34.01 57.91,33.49 57.91,11.35

Small or netless copper shapes (teardrops, artwork), in the pictures only: 250 on Top Layer, 46 on Bottom Layer

## Text on the board
Top Silkscreen Layer: 5V V_OUT GND | 5V V_DC GND | 5V RELAY_EN GND | 5V V_GRID GND | 3V3  I_DC  GND | 3V3  IL2  GND | 3V3  IL1  GND | 3V3  IC  GND | GND | 5V | C2 | A0 | A2 | A6 | C4 | B0 | B2 | B10 | C6 | A8 | A10 | A12 | C12 | B3 | B5 | B8 | C13 | C0 | A5 | C1 | C3 | A4 | A7 | C5 | B1 | A1 | A11 | B15 | C7 | A9 | A15 | D2 | B4 | B6 | B9 | RELAY_EN | VDC | VOUT | VGRID | IDC | IL2 | IC | IL1 | PWM1_H | PWM1_L | DIS2 | DIS1 | VS2 | VS1 | 辅助电源供电 | VCC | V_DC+ | I_DC+ | VIN | I_DC- | V_DC-
